# EAGLE design Nose IR emitter 1.2 (EAGLE 9.2.2)
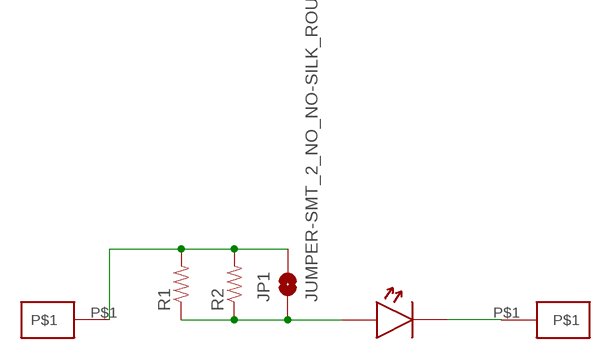
[diagram p0: schematic, sheet 1]

## Parts
JP1  JUMPER-SMT_2_NO_NO-SILK_ROUND  [SMT-JUMPER_2_NO_NO-SILK_ROUND]
R1  RESISTOR0805-RES  [0805]
R2  RESISTOR0805-RES  [0805]
U$1  IR_EMITTER  [IR_EMITTER]
U$2  PAD  [PAD]
U$3  PAD  [PAD]

## Nets
N$1: JP1.1 R1.1 R2.1 U$1.ANODE
N$2: U$1.CATHODE U$3.P$1
N$3: JP1.2 R1.2 R2.2 U$2.P$1

## Library data of the parts
JP1 = SparkFun-Jumpers:JUMPER-SMT_2_NO: Normally open jumper This jumper has two pads in close proximity to each other. Apply solder to close the connection. Round pads are easier to solder for beginners, but are a lot larger. SparkFun Product that uses the round pads: SparkFun EL Sequencer <https://www.sparkfun.com/products/12781>
R1 R2 = Andy-library:RESISTOR: Resistor Basic schematic elements and footprints for 0603, 1206, and PTH resistors.
U$1 = Andy-library:IR_EMITTER: MPN: IR26-21C/L110/TR8 Digkikey: 1080-1357-1-ND <https://www.digikey.com/products/en?x=0&y=0&lang=en&site=us&keywords=1080-1357-1>
U$2 U$3 = Andy-library:PAD

## Board
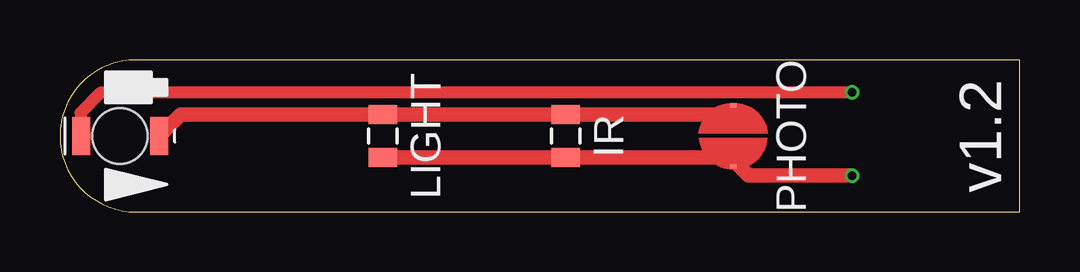
[diagram p1: board, top side]
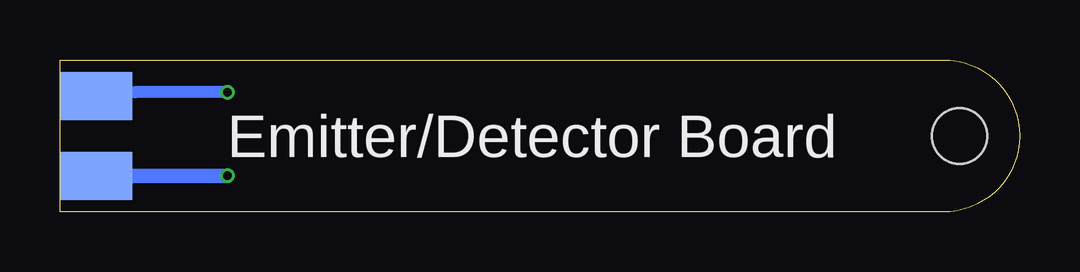
[diagram p2: board, bottom side, seen from below]

Size 40 x 6.35 mm. Coordinates in mm from the lower left corner, seen from the top.
Outline: 40,6.35 3.17,6.35 arc90 0,3.17 arc90 3.17,0 40,0 40,6.35
Copper layers (1*16): Top 0.035559375mm / dielectric 1.6mm / Bottom 0.035559375mm
Design rules "oshpark-2layer *": minimum track width 6mil, minimum drill 10mil, track to track 6mil, track to pad 6mil, pad to pad 6mil, via to via 6mil, smd to smd 6mil, copper to edge 15mil, drill to drill 6mil, minimum pad ring 5mil, minimum via ring 5mil, stop-mask expansion 2.5mil, vias tented up to drill 0mil, thermal gap 10mil

### Footprints (pad centres in the part's own frame; a part is rotated, then mirrored left to right if it is on the bottom)
SMT-JUMPER_2_NO_NO-SILK_ROUND = smd 0.152 x 0.305: 1 -1.27,0; 2 1.27,0
0805 = smd 0.8 x 1.2: 1 -0.9,0; 2 0.9,0
IR_EMITTER = smd 1.6 x 0.75: ANODE 0,-1.625; CATHODE 0,1.625 | hole 2.3: 0,0
PAD = smd 2 x 3: P$1 0,1.5

### Placement (x,y rotation side)
JP1  28.07,3.17 270 top
R1  13.46,3.17 270 top
R2  21.08,3.17 270 top
U$1  2.5,3.17 90 top
U$2  37,1.5 90 bottom
U$3  37,4.85 90 bottom

### Tracks (layer width: path | path; a pad name or v marks a point on that pad's centre or on a via)
N$1
  Top 0.152: JP1.1 27.99,4.24 27.99,4.08
  Top 0.61: U$1.ANODE 5.03,4.08 R1.1 R2.1 27.99,4.08 28.26,3.81
N$2  (via drill 0.35)
  Top 0.508: U$1.CATHODE 0.86,3.19 0.86,4.14 1.73,5 v33.02,5
  Bottom 0.508: v33.02,5 36.85,5 U$3.P$1
N$3  (via drill 0.35)
  Top 0.152: 28.26,1.97 JP1.2
  Top 0.61: R1.2 R2.2 27.95,2.27 28.26,1.97 28.7,1.52 v33.02,1.52
  Bottom 0.61: U$2.P$1 33.04,1.5 v33.02,1.52

### Text on the board
tNames: LIGHT | IR | PHOTO | v1.2
bNames: Emitter/Detector Board